# Altium schematic sheet PLD_ADC.SchDoc: ADC for SunSref,Photodiodes and HK
size A4; SheetTotal: 32
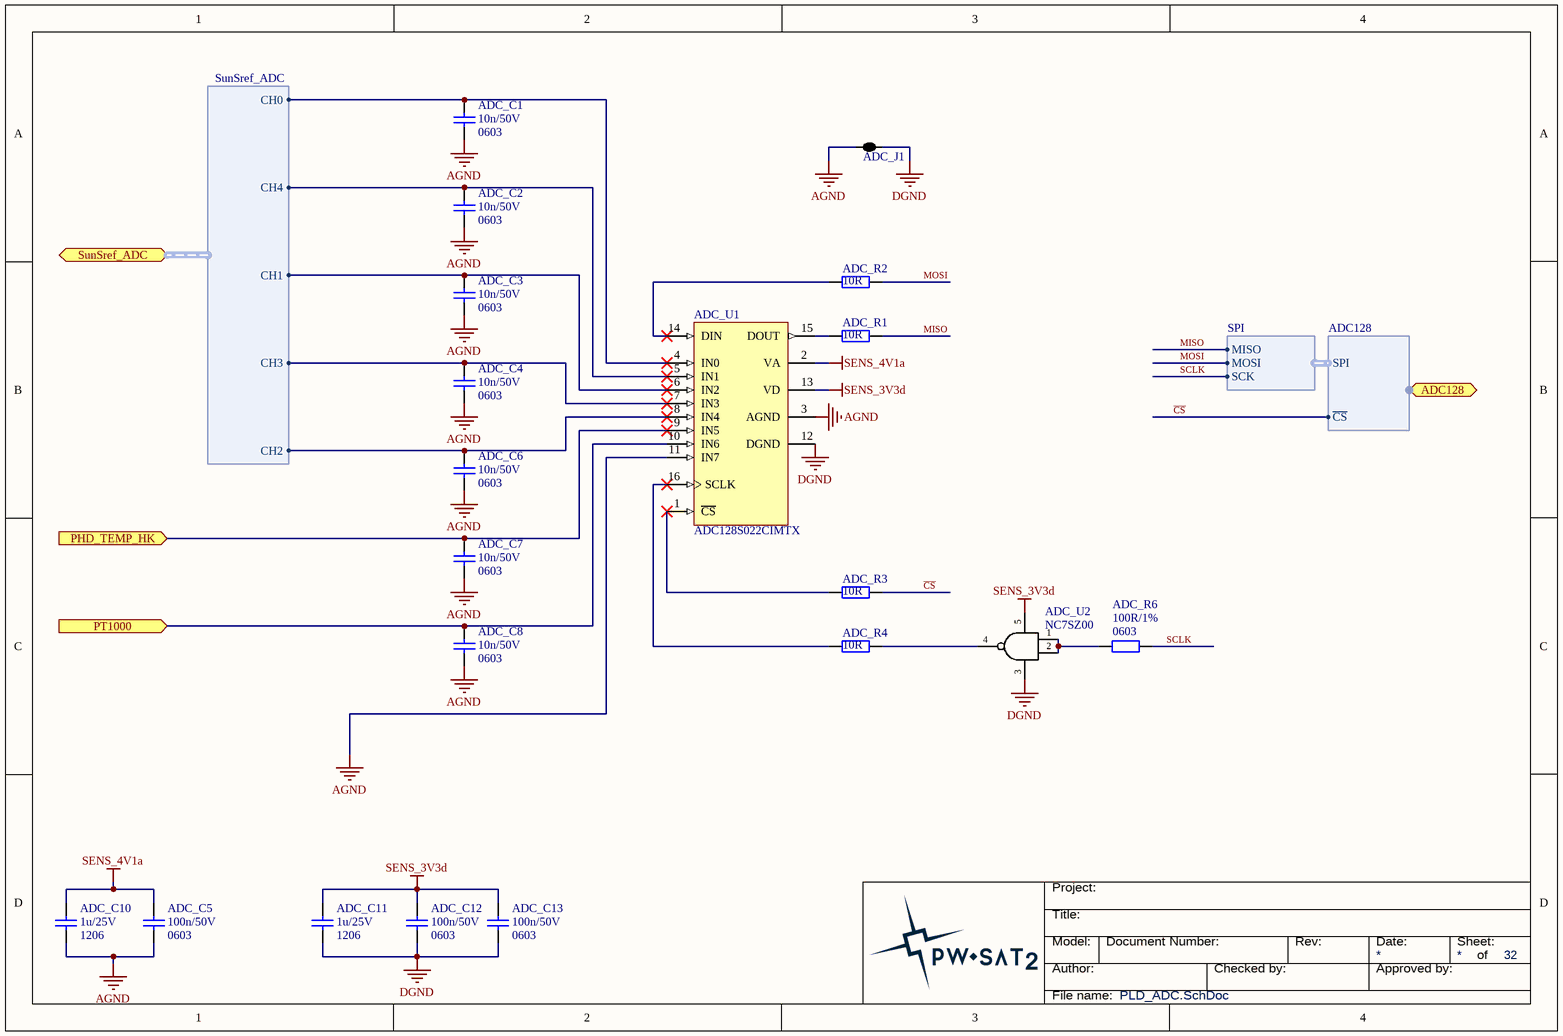
[diagram p0: PLD_ADC.SchDoc]

## Parts
ADC_C1  value 10n/50V  Package: 0603  [SMD_Capacitor_0603]  (hidden comment: Cap)
ADC_C2  value 10n/50V  Package: 0603  [SMD_Capacitor_0603]  (hidden comment: Cap)
ADC_C3  value 10n/50V  Package: 0603  [SMD_Capacitor_0603]  (hidden comment: Cap)
ADC_C4  value 10n/50V  Package: 0603  [SMD_Capacitor_0603]  (hidden comment: Cap)
ADC_C5  Package: 0603  [SMD_Capacitor_0603]  (hidden comment: 100n/50V)
ADC_C6  value 10n/50V  Package: 0603  [SMD_Capacitor_0603]  (hidden comment: Cap)
ADC_C7  value 10n/50V  Package: 0603  [SMD_Capacitor_0603]  (hidden comment: Cap)
ADC_C8  value 10n/50V  Package: 0603  [SMD_Capacitor_0603]  (hidden comment: Cap)
ADC_C10  Package: 1206  [SMD_Capacitor_1206]  (hidden comment: 1u/25V)
ADC_C11  Package: 1206  [SMD_Capacitor_1206]  (hidden comment: 1u/25V)
ADC_C12  Package: 0603  [SMD_Capacitor_0603]  (hidden comment: 100n/50V)
ADC_C13  Package: 0603  [SMD_Capacitor_0603]  (hidden comment: 100n/50V)
ADC_J1  2 way net tie junction  [2way_LP]  (value not drawn)  (net tie, no BOM)
ADC_R1  10R  [SMD_Resistor_0603]
ADC_R2  10R  [SMD_Resistor_0603]
ADC_R3  10R  [SMD_Resistor_0603]
ADC_R4  10R  [SMD_Resistor_0603]
ADC_R6  Package: 0603  [SMD_Resistor_0603]  (hidden comment: 100R/1%)
ADC_U1  ADC128S022CIMTX  [TSSOP16]
ADC_U2  NC7SZ00  [SOT23-5]

## Ports
ADC128 (harness ADC128), PHD_TEMP_HK (in), PT1000 (in), SunSref_ADC (harness SunSref_ADC)

## Harnesses
SPI: MISO, MOSI, SCK
SunSref_ADC: CH0, CH1, CH2, CH3, CH4
ADC128: SPI, ~{CS}

## Nets
AGND: ADC_C1.2 ADC_C2.2 ADC_C3.2 ADC_C4.2 ADC_C5.2 ADC_C6.2 ADC_C7.2 ADC_C8.2 ADC_C10.2 ADC_J1.1 ADC_U1.3(AGND) ADC_U1.11(IN7)
DGND: ADC_C11.2 ADC_C12.2 ADC_C13.2 ADC_J1.2 ADC_U1.12(DGND) ADC_U2.3(GND)
SENS_3V3d: ADC_C11.1 ADC_C12.1 ADC_C13.1 ADC_U1.13(VD) ADC_U2.5(Vcc)
SENS_4V1a: ADC_C5.1 ADC_C10.1 ADC_U1.2(VA)
~{CS}: ADC_R3.2 ; port ADC128.~{CS}
MISO: ADC_R1.2 ; harness SPI.MISO
MOSI: ADC_R2.2 ; harness SPI.MOSI
PHD_TEMP_HK: ADC_C7.1 ADC_U1.9(IN5) ; port PHD_TEMP_HK
PT1000: ADC_C8.1 ADC_U1.10(IN6) ; port PT1000
SCLK: ADC_R6.2 ; harness SPI.SCK
NetADC_C1_1: ADC_C1.1 ADC_U1.4(IN0) ; port SunSref_ADC.CH0
NetADC_C2_1: ADC_C2.1 ADC_U1.5(IN1) ; port SunSref_ADC.CH4
NetADC_C3_1: ADC_C3.1 ADC_U1.6(IN2) ; port SunSref_ADC.CH1
NetADC_C4_1: ADC_C4.1 ADC_U1.7(IN3) ; port SunSref_ADC.CH3
NetADC_C6_1: ADC_C6.1 ADC_U1.8(IN4) ; port SunSref_ADC.CH2
NetADC_R1_1: ADC_R1.1 ADC_U1.15(DOUT)
NetADC_R2_1: ADC_R2.1 ADC_U1.14(DIN)
NetADC_R3_1: ADC_R3.1 ADC_U1.1(~{CS})
NetADC_R4_1: ADC_R4.1 ADC_U1.16(SCLK)
NetADC_R4_2: ADC_R4.2 ADC_U2.4(Y)
NetADC_R6_1: ADC_R6.1 ADC_U2.1(A) ADC_U2.2(B)

## Notes on the sheet
- Title:
- Project:
- Author:
- Model:
- Document Number:
- Checked by:
- Rev:
- Date:
- Approved by:
- Sheet:
- of
- File name:

## Library data of the parts
ADC_C5 ADC_C12 ADC_C13 = Cer_C0603T104K5RALTU: Ceramic Cap Kemet COTS 100n/50V X7R 0603; Manufacturer: Kemet; ManufacturerPartNumber: C0603T104K5RALTU; Value: 100n/50V
ADC_C10 ADC_C11 = Cer_C1206T105K3RALTU: Ceramic Cap Kemet COTS 1u/25V X7R 1206; ManufacturerPartNumber: C1206T105K3RALTU; Manufacturer: Kemet; Value: 1u/25V
ADC_J1 = 2way: ComponentLink1URL: http://www.edatools.cz/addons; ComponentLink1Description: Source; FootprintNote: LP=12mil, MP=40mil, HP=120mil
ADC_R1-ADC_R4 = Res: Value: 10R; Package: 0603
ADC_R6 = CRCW0603100RFKxxxx: 100R/1% Vishay CRCW 0603 Resistor. 100mW, 100ppm, 75V.; Manufacturer: Vishay; ManufacturerPartNumber: CRCW0603100RFKxxxx; Value: 100R/1%
ADC_U1 = ADC128S022CIMTX: ADC128S022 8-Channel, 50 kSPS to 200 kSPS, 12-Bit A/D Converter; Manufacturer: Texas Instruments; Category: ADC; ManufacturerPartNumber: ADC128S022CIMTX
ADC_U2 = NC7SZ00: TinyLogic UHS Two-Input NAND Gate.; Manufacturer: Fairchild Semiconductor; Value: NC7SZ00